# EAGLE design clock (EAGLE 9.6.0)
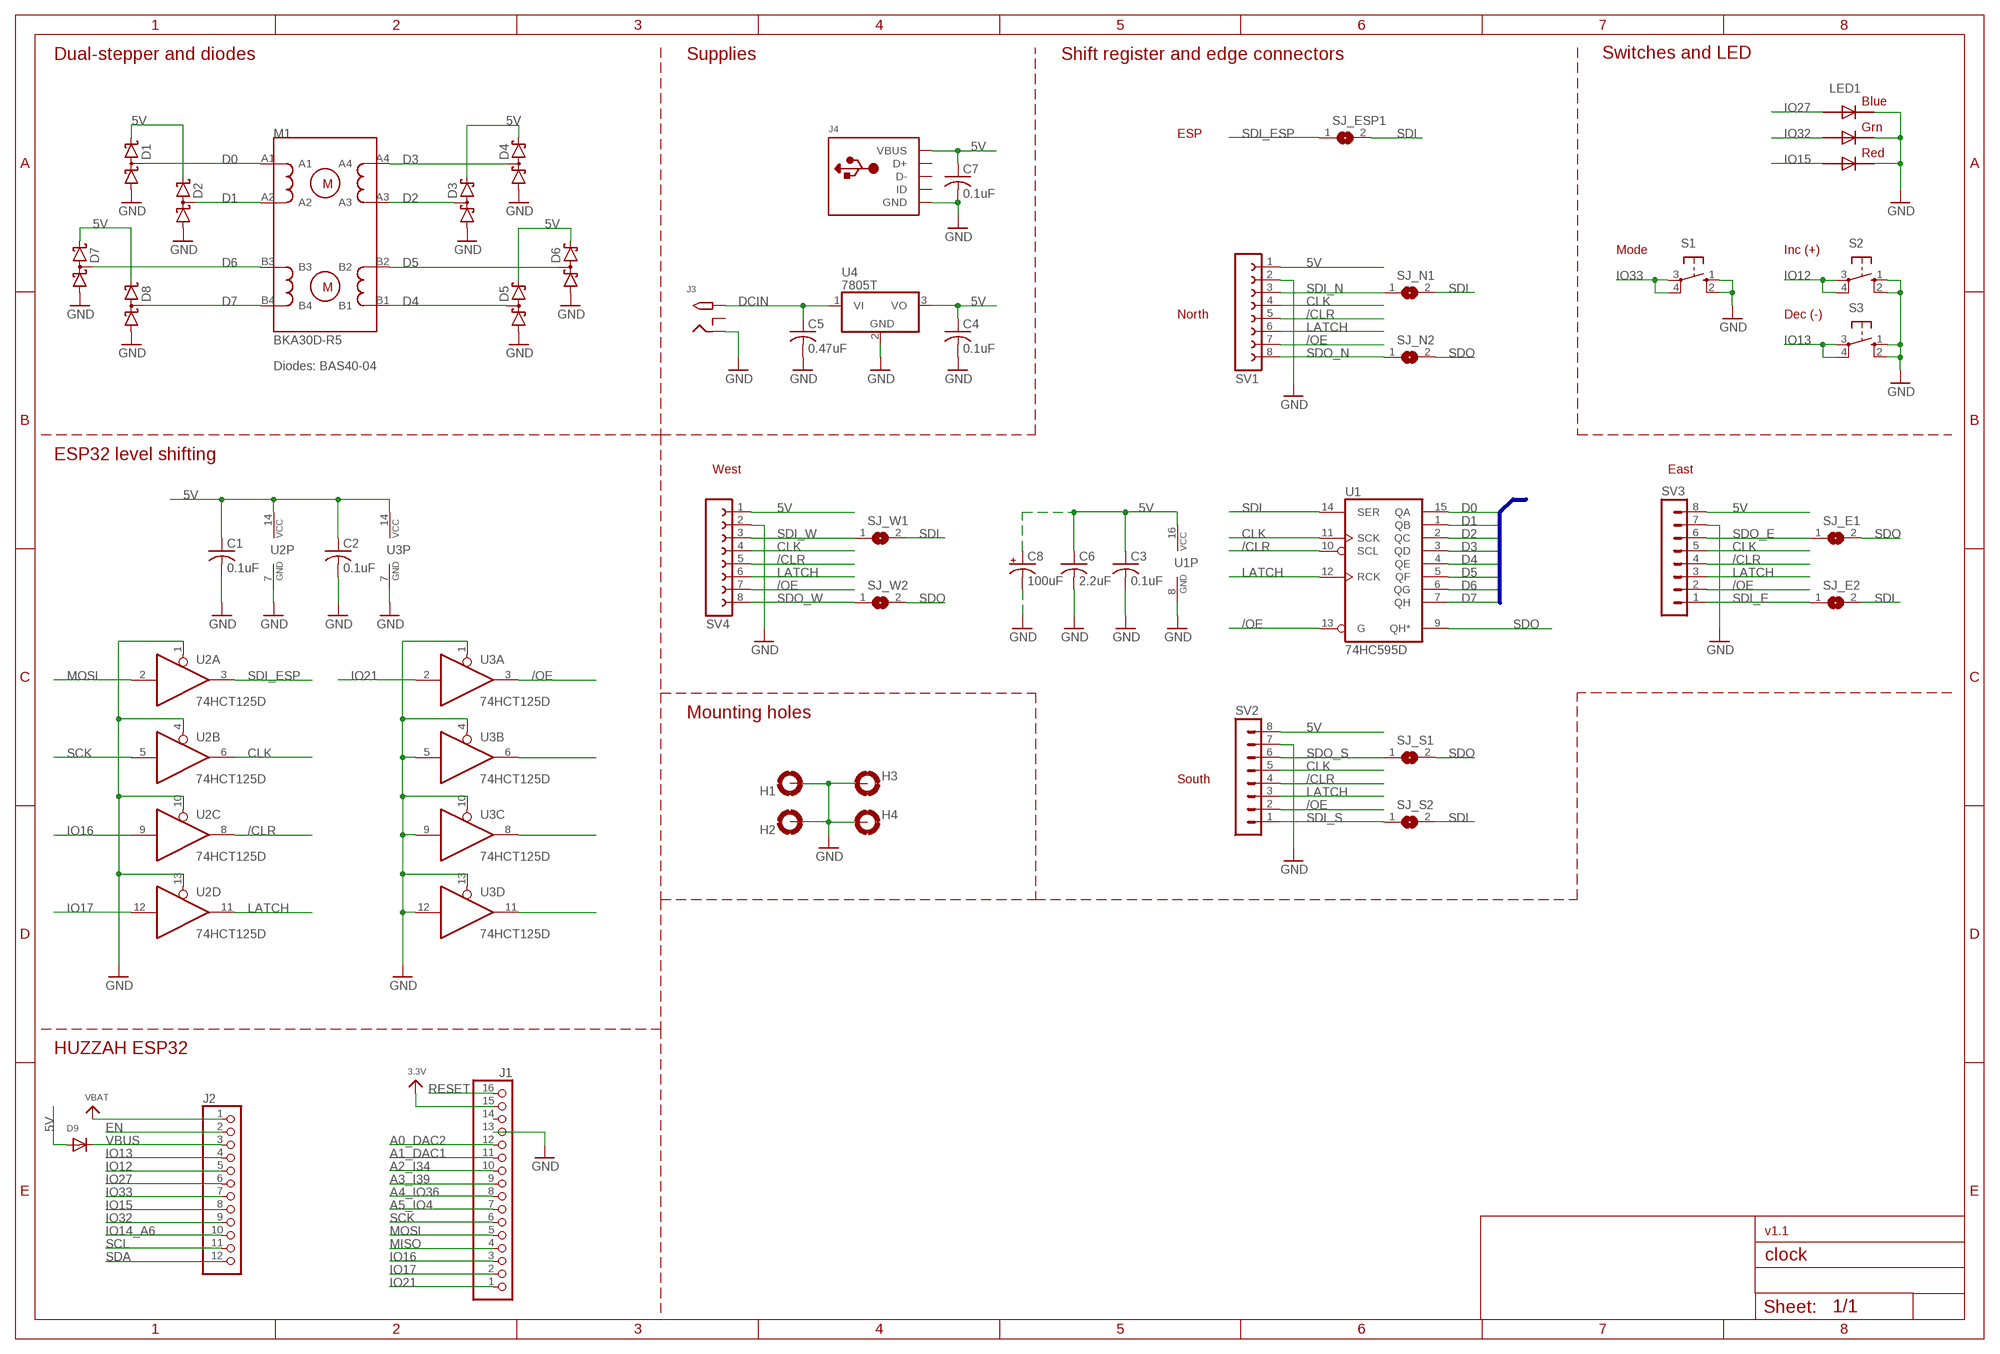
[diagram p0: schematic, sheet 1]

## Parts
C1  0.1uF  C-USC0805K  [C0805K]
C2  0.1uF  C-USC0805K  [C0805K]
C3  0.1uF  C-USC0805K  [C0805K]
C4  0.1uF  C-USC0805K  [C0805K]
C5  0.47uF  C-USC0805K  [C0805K]
C6  2.2uF  C-USC0805K  [C0805K]
C7  0.1uF  C-USC0805K  [C0805K]
C8  100uF  CPOL-USE3.5-8  [E3,5-8]
D1  BAS40-04  [SOT23]
D2  BAS40-04  [SOT23]
D3  BAS40-04  [SOT23]
D4  BAS40-04  [SOT23]
D5  BAS40-04  [SOT23]
D6  BAS40-04  [SOT23]
D7  BAS40-04  [SOT23]
D8  BAS40-04  [SOT23]
D9  DIODEDO-1N4148  [DO-1N4148]
H1  MOUNT-PAD-ROUND3.2  [3,2-PAD]
H2  MOUNT-PAD-ROUND3.2  [3,2-PAD]
H3  MOUNT-PAD-ROUND3.2  [3,2-PAD]
H4  MOUNT-PAD-ROUND3.2  [3,2-PAD]
J1  HEADER-1X16_MIN  [1X16_ROUND_MIN]
J2  HEADER-1X12_MIN  [1X12_ROUND_MIN]
J3  2.1MMJACKTHM  [PJ-102A]
J4  USBMINIB  [USB-MINIB]
LED1  RGBLED5050  [RGBLED5050]
M1  BKA30D-R5  [BKA30D-R5]
S1  10-XX  [B3F-10XX]
S2  10-XX  [B3F-10XX]
S3  10-XX  [B3F-10XX]
SJ_E1  SJ  [SJ]
SJ_E2  SJ  [SJ]
SJ_ESP1  SJ  [SJ]
SJ_N1  SJ  [SJ]
SJ_N2  SJ  [SJ]
SJ_S1  SJ  [SJ]
SJ_S2  SJ  [SJ]
SJ_W1  SJ  [SJ]
SJ_W2  SJ  [SJ]
SV1  FE08W  [FE08W]
SV2  MA08-1W  [MA08-1W]
SV3  MA08-1W  [MA08-1W]
SV4  FE08W  [FE08W]
U1  74HC595D  [SO16]
U2  74HCT125D  [SO14]
U3  74HCT125D  [SO14]
U4  7805T  [TO220H]

## Nets
3.3V: J1.15
5V: C1.1 C2.1 C3.1 C4.1 C6.1 C7.1 C8.+ D1.2(C2) D2.2(C2) D3.2(C2) D4.2(C2) D5.2(C2) D6.2(C2) D7.2(C2) D8.2(C2) D9.A J4.VBUS SV1.1 SV2.8 SV3.8 SV4.1 U1.16(VCC) U2.14(P:VCC) U3.14(P:VCC) U4.3(VO)
/CLR: SV1.5 SV2.4 SV3.4 SV4.5 U1.10(SCL) U2.8(C:O)
/OE: SV1.7 SV2.2 SV3.2 SV4.7 U1.13(G) U3.3(A:O)
A0_DAC2: J1.12
A1_DAC1: J1.11
A2_I34: J1.10
A3_I39: J1.9
A4_IO36: J1.8
A5_IO4: J1.7
CLK: SV1.4 SV2.5 SV3.5 SV4.4 U1.11(SCK) U2.6(B:O)
D0: D1.3(C1A2) M1.A1 U1.15(QA)
D1: D2.3(C1A2) M1.A2 U1.1(QB)
D2: D3.3(C1A2) M1.A3 U1.2(QC)
D3: D4.3(C1A2) M1.A4 U1.3(QD)
D4: D5.3(C1A2) M1.B1 U1.4(QE)
D5: D6.3(C1A2) M1.B2 U1.5(QF)
D6: D7.3(C1A2) M1.B3 U1.6(QG)
D7: D8.3(C1A2) M1.B4 U1.7(QH)
DCIN: C5.1 J3.TIP U4.1(VI)
EN: J2.2
GND: C1.2 C2.2 C3.2 C4.2 C5.2 C6.2 C7.2 C8.- D1.1(A1) D2.1(A1) D3.1(A1) D4.1(A1) D5.1(A1) D6.1(A1) D7.1(A1) D8.1(A1) H1.B3,2(MOUNT) H2.B3,2(MOUNT) H3.B3,2(MOUNT) H4.B3,2(MOUNT) J1.13 J3.RING J4.GND LED1.4(BLUE_C) LED1.5(RED_C) LED1.6(GREEN_C) S1.1(S) S1.2(S1) S2.1(S) S2.2(S1) S3.1(S) S3.2(S1) SV1.2 SV2.7 SV3.7 SV4.2 U1.8(GND) U2.1(A:OE) U2.4(B:OE) U2.7(P:GND) U2.10(C:OE) U2.13(D:OE) U3.1(A:OE) U3.4(B:OE) U3.5(B:I) U3.7(P:GND) U3.9(C:I) U3.10(C:OE) U3.12(D:I) U3.13(D:OE) U4.2(GND)
IO12: J2.5 S2.3(P) S2.4(P1)
IO13: J2.4 S3.3(P) S3.4(P1)
IO14_A6: J2.10
IO15: J2.8 LED1.2(RED_A)
IO16: J1.3 U2.9(C:I)
IO17: J1.2 U2.12(D:I)
IO21: J1.1 U3.2(A:I)
IO27: J2.6 LED1.3(BLUE_A)
IO32: J2.9 LED1.1(GREEN_A)
IO33: J2.7 S1.3(P) S1.4(P1)
LATCH: SV1.6 SV2.3 SV3.3 SV4.6 U1.12(RCK) U2.11(D:O)
MISO: J1.4
MOSI: J1.5 U2.2(A:I)
N$1: U3.11(D:O)
N$2: U3.8(C:O)
N$3: U3.6(B:O)
RESET: J1.16
SCK: J1.6 U2.5(B:I)
SCL: J2.11
SDA: J2.12
SDI: SJ_E2.2 SJ_ESP1.2 SJ_N1.2 SJ_S2.2 SJ_W1.2 U1.14(SER)
SDI_E: SJ_E2.1 SV3.1
SDI_ESP: SJ_ESP1.1 U2.3(A:O)
SDI_N: SJ_N1.1 SV1.3
SDI_S: SJ_S2.1 SV2.1
SDI_W: SJ_W1.1 SV4.3
SDO: SJ_E1.2 SJ_N2.2 SJ_S1.2 SJ_W2.2 U1.9(QH*)
SDO_E: SJ_E1.1 SV3.6
SDO_N: SJ_N2.1 SV1.8
SDO_S: SJ_S1.1 SV2.6
SDO_W: SJ_W2.1 SV4.8
VBAT: J2.1
VBUS: D9.C J2.3
Unconnected: J1.14 J3.RING_SW J4.D+ J4.D- J4.ID

## Buses
D[0..7]

## Notes on the sheet
- Dual-stepper and diodes | Supplies | Shift register and edge connectors | Switches and LED
- ESP
- Mode | Inc (+)
- North | Dec (-)
- Diodes: BAS40-04
- ESP32 level shifting
- West | East
- Mounting holes
- South
- HUZZAH ESP32
- v1.1

## Library data of the parts
C1-C7 = rcl:C-US: CAPACITOR, American symbol; SPICEPREFIX: C
C8 = rcl:CPOL-US: POLARIZED CAPACITOR, American symbol; SPICEPREFIX: C
D1-D8 = diode:BAS40-04: Silicon Schottky Diodes General-purpose diode for high-speed switching
D9 = adafruit:DIODE: Diode SMADIODE - SMA Surface Mount Package 20V 1A Schottky Diode Digikey: 641-1014-6-ND DO-1N4148 - Through Hole Small Current Diode SOD-123 20V 1 A (.5mV Vf) Schottky Diode - Digikey: MBRX120TPMSCT-ND SOD-323 10V 570mA (.38mV Vf, 3ns) Schottky Diode - Digikey: ZLLS410CT-ND SOD-523 30V 30mA Schottky Diode (RB751S-40TE61) - Digikey: RB751S-40TE61CT-ND SOT23-R/W - SOT23 Package (R = Solder Paste/Reflow Ovens, W = Hand-Soldering) BAT54Film 40V 300mA - Digikey: 497-7162-1-ND
H1-H4 = holes:MOUNT-PAD-ROUND: MOUNTING PAD, round
J1 = microbuilder:HEADER-1X16: PIN HEADER
J2 = microbuilder:HEADER-1X12
J3 = adafruit:2.1MMJACK: 2.1mm x 5.5mm THM DC jack with internal switch. Digikey part #PJ-102A, 4UCON part #05537 2.1mm x 5.5mm SMT DC jack with internal switch. Digikey part #PJ-002A-SMT, 4UCON part #03267 By microbuilder.eu & adafruit.com
J4 = adafruit:USB: USB Connectors USBMINIB - Surface Mount Female Mini-B USB Connector 4UConnector: 06564 By microbuilder.eu Thru-hole RA Female Mini-B USB Connector 4UConnector: 18732 By ladyada.net
LED1 = adafruit:RGBLED: For 5050 RGB LEDs, the order of the LEDs may vary from one manufacturer to another!
M1 = my_components:BKA30D-R5
S1-S3 = switch-omron:10-XX: OMRON SWITCH; MPN: B3F-1000; OC_FARNELL: 176432; OC_NEWARK: 36M3542
SJ_E1 SJ_E2 SJ_ESP1 SJ_N1 SJ_N2 SJ_S1 SJ_S2 SJ_W1 SJ_W2 = jumper:SJ: SMD solder JUMPER
SV1 SV4 = con-lsta:FE08W: FEMALE HEADER; OC_FARNELL: unknown; OC_NEWARK: unknown
SV2 SV3 = con-lstb:MA08-1W: PIN HEADER; OC_FARNELL: unknown; OC_NEWARK: unknown
U1 = 74xx-eu:74*595: 8-bit SHIFT REGISTER, output latch
U2 U3 = 74xx-eu:74*125: Quad bus BUFFER, 3-state
U4 = adafruit:78*: Positive VOLTAGE REGULATOR Added bigger pads to the TO-92 package

## Board
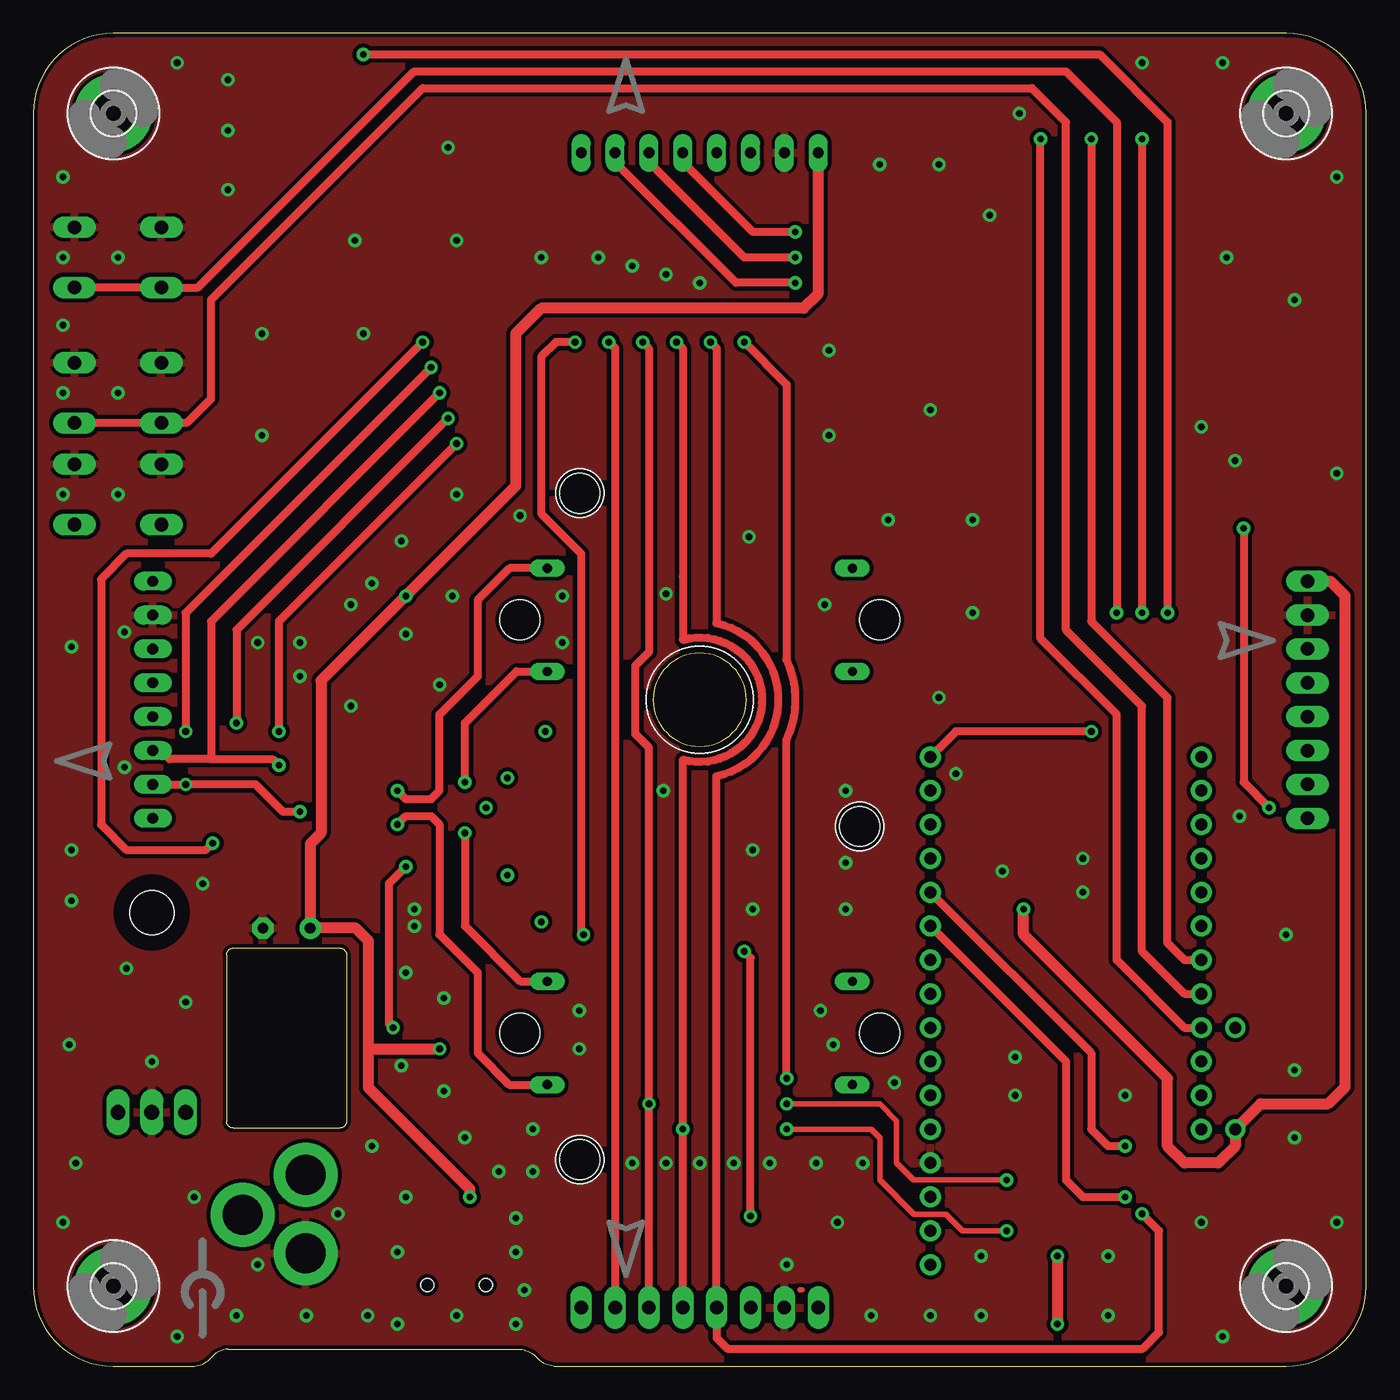
[diagram p1: board, top side]
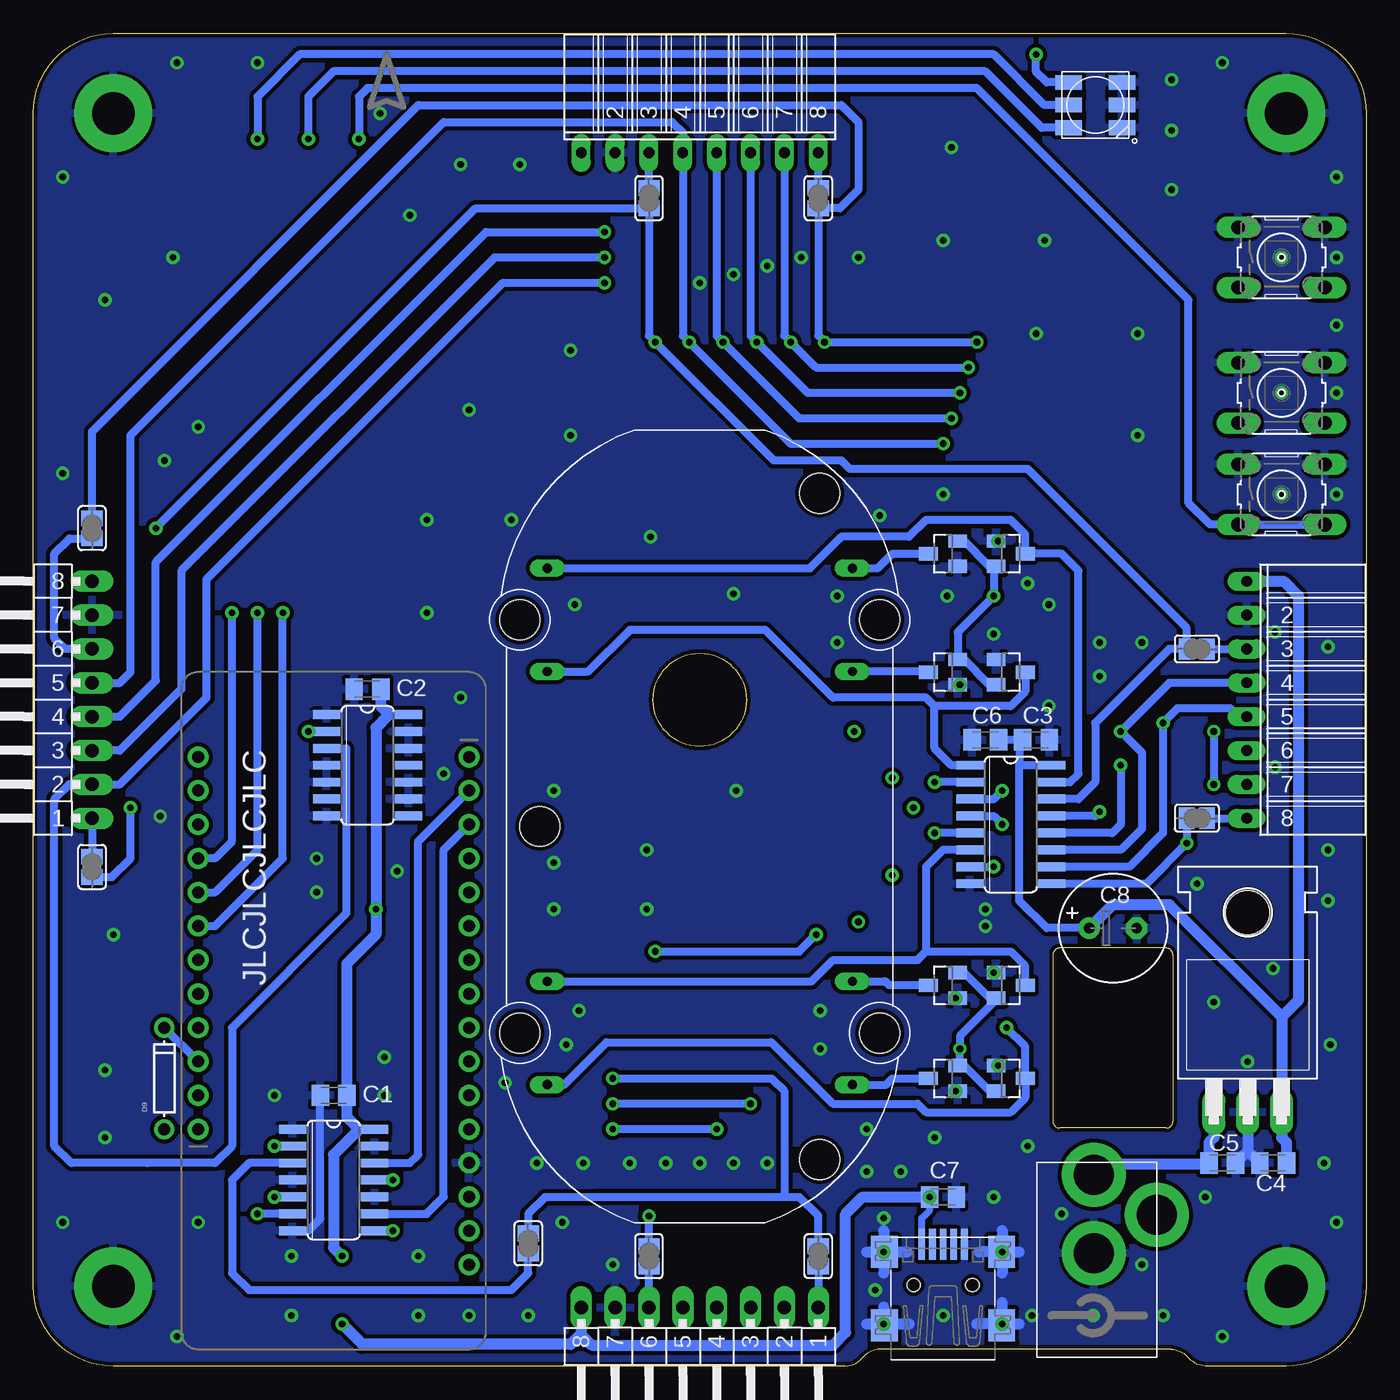
[diagram p2: board, bottom side, seen from below]

Size 100 x 100 mm. Coordinates in mm from the lower left corner, seen from the top.
Outline: 6,0 12.06,0 arc45 13.34,0.64 arc-45 14.61,1.27 36.51,1.27 arc-45 37.78,0.64 arc45 39.05,0 94,0 arc90 100,6 100,94 arc90 94,100 6,100 arc90 0,94 0,6 arc90 6,0
Outline: 14.5,30.86 14.5,18.36 arc90 15,17.86 23,17.86 arc90 23.5,18.36 23.5,30.86 arc90 23,31.36 15,31.36 arc90 14.5,30.86
Copper layers (1*16): Top 0.035559375mm / dielectric 1.6mm / Bottom 0.035559375mm
Design rules "jlcpcb2layer": minimum track width 5mil, minimum drill 8mil, track to track 5mil, track to pad 5mil, pad to pad 20mil, via to via 10mil, smd to smd 5mil, copper to edge 8mil, drill to drill 20mil, minimum pad ring 12mil, minimum via ring 5mil, stop-mask expansion 2.5mil, vias tented up to drill 20mil, thermal gap 10mil

### Footprints (pad centres in the part's own frame; a part is rotated, then mirrored left to right if it is on the bottom)
C0805K = smd 1.3 x 1.6: 1 -1,0; 2 1,0
E3,5-8 = drill 0.813 pad 1.6: + -1.778,0 | drill 0.813 pad 1.6 octagon: - 1.778,0
SOT23 = smd 1 x 1.4: 1 -0.95,-1.1; 2 0.95,-1.1; 3 0,1.1
DO-1N4148 = drill 0.9: A -3.81,0; C 3.81,0
3,2-PAD = drill 3.2 pad 5.842: B3,2 0,0
1X16_ROUND_MIN = drill 0.9 pad 1.575: 1 -19.05,0; 2 -16.51,0; 3 -13.97,0; 4 -11.43,0; 5 -8.89,0; 6 -6.35,0; 7 -3.81,0; 8 -1.27,0; 9 1.27,0; 10 3.81,0; 11 6.35,0; 12 8.89,0; 13 11.43,0; 14 13.97,0; 15 16.51,0; 16 19.05,0
1X12_ROUND_MIN = drill 0.9 pad 1.575: 1 -13.97,0; 2 -11.43,0; 3 -8.89,0; 4 -6.35,0; 5 -3.81,0; 6 -1.27,0; 7 1.27,0; 8 3.81,0; 9 6.35,0; 10 8.89,0; 11 11.43,0; 12 13.97,0
PJ-102A = drill 3 pad 4.8: RING 0.1,-3.39; RING_SW -4.6,-6.29; TIP 0.1,-9.29
USB-MINIB = smd 0.5 x 2.308: D+ 0,4.064; D- -0.8,4.064; GND 1.6,4.064; ID 0.8,4.064; VBUS -1.6,4.064 | smd 2 x 2.4: GND1 -4.4,-2; GND2 -4.4,3.5; GND3 4.4,3.5; GND4 4.4,-2 | hole 1: -2.2,1; 2.2,1
RGBLED5050 = smd 2 x 1.1: 1 -2,1.7; 2 -2,0; 3 -2,-1.7; 4 2,-1.7; 5 2,0; 6 2,1.7
BKA30D-R5 = drill 0.7 long: A1 19.375,11.45; A2 11.625,11.45; A3 11.625,-11.45; A4 19.375,-11.45; B1 -19.375,-11.45; B2 -11.625,-11.45; B3 -11.625,11.45; B4 -19.375,11.45 | hole 3: -15.5,13.5; -15.5,-13.5; 15.5,-13.5; 15.5,13.5; -25,-9; 25,-9; 0,12
B3F-10XX = drill 1.016 long: 1 -3.251,2.261; 2 3.251,2.261; 3 -3.251,-2.261; 4 3.251,-2.261
SJ = smd 1.168 x 1.6: 1 -0.762,0; 2 0.762,0
FE08W = drill 0.813 long: 1 -8.89,0; 2 -6.35,0; 3 -3.81,0; 4 -1.27,0; 5 1.27,0; 6 3.81,0; 7 6.35,0; 8 8.89,0
MA08-1W = drill 1.016 long: 1 -8.89,0; 2 -6.35,0; 3 -3.81,0; 4 -1.27,0; 5 1.27,0; 6 3.81,0; 7 6.35,0; 8 8.89,0
SO16 = smd 0.66 x 2.032: 1 -4.445,-3.073; 2 -3.175,-3.073; 3 -1.905,-3.073; 4 -0.635,-3.073; 5 0.635,-3.073; 6 1.905,-3.073; 7 3.175,-3.073; 8 4.445,-3.073; 9 4.445,3.073; 10 3.175,3.073; 11 1.905,3.073; 12 0.635,3.073; 13 -0.635,3.073; 14 -1.905,3.073; 15 -3.175,3.073; 16 -4.445,3.073
SO14 = smd 0.66 x 2.032: 1 -3.81,-3.073; 2 -2.54,-3.073; 3 -1.27,-3.073; 4 0,-3.073; 5 1.27,-3.073; 6 2.54,-3.073; 7 3.81,-3.073; 8 3.81,3.073; 9 2.54,3.073; 10 1.27,3.073; 11 0,3.073; 12 -1.27,3.073; 13 -2.54,3.073; 14 -3.81,3.073
TO220H = drill 1.118 long: 1 -2.54,-10.16; 2 0,-10.16; 3 2.54,-10.16 | hole 3.302: 0,4.826

### Placement (x,y rotation side)
C1  77.47,20.32 180 bottom
C2  74.93,50.8 180 bottom
C3  24.77,46.99 0 bottom
C4  6.99,15.24 180 bottom
C5  10.79,15.24 0 bottom
C6  28.57,46.99 180 bottom
C7  31.75,12.7 0 bottom
C8  19,32.87 0 bottom
D1  26.67,60.96 270 bottom
D2  26.67,52.07 270 bottom
D3  31.75,52.07 90 bottom
D4  31.75,60.96 90 bottom
D5  31.75,21.59 90 bottom
D6  31.75,28.57 90 bottom
D7  26.67,28.57 270 bottom
D8  26.67,21.59 270 bottom
D9  90.17,21.59 90 bottom
H1  6,94 0 top
H2  94,94 0 top
H3  6,6 0 top
H4  94,6 0 top
J1  67.31,26.67 270 bottom
J2  87.63,31.75 90 bottom
J3  20.32,5.08 180 bottom
J4  31.75,5.08 0 bottom
LED1  20.32,94.61 0 bottom
M1  50,40.5 90 bottom
S1  6.35,83.19 0 bottom
S2  6.35,73.03 0 bottom
S3  6.35,65.41 0 bottom
SJ_E1  95.6,62.87 90 bottom
SJ_E2  95.6,37.47 270 bottom
SJ_ESP1  62.87,9.21 90 bottom
SJ_N1  53.81,87.63 270 bottom
SJ_N2  41.11,87.63 270 bottom
SJ_S1  53.81,8.26 90 bottom
SJ_S2  41.11,8.26 90 bottom
SJ_W1  12.7,53.81 180 bottom
SJ_W2  12.7,41.11 180 bottom
SV1  50,91.04 0 bottom
SV2  50,4.4 180 bottom
SV3  95.6,50 90 bottom
SV4  8.96,50 270 bottom
U1  26.67,40.64 270 bottom
U2  77.47,13.97 270 bottom
U3  74.93,45.09 270 bottom
U4  8.89,29.21 0 bottom

### Tracks (layer width: path | path; a pad name or v marks a point on that pad's centre or on a via)
5V  (via drill 0.5 pad 1)
  Top 0.813: C7.1 32.75,13.29 25.14,20.9 25.14,23.81 | SV1.1 58.89,80.48 57.78,79.38 38.1,79.38 36.2,77.47 36.2,66.04 v27.94,57.78 21.59,51.44 21.59,40.01 20.78,39.19 C8.+ 24.18,32.87 25.14,31.91 25.14,23.81 | v76.83,8.26 v76.83,3.17 | SV3.8 97.32,58.89 98.42,57.78 98.42,20.95 97.16,19.68 92.08,19.68 D9.A 90.17,16.51 88.9,15.24 86.36,15.24 85.09,16.51 85.09,21.59 74.3,32.38 v74.3,34.29 | 25.14,23.81 v30.48,23.81
  Bottom 0.508: J4.VBUS 33.35,11.1 32.75,11.7 C7.1
  Bottom 0.61: 73.3,48.9 U3.14 | U2.14 75.56,17.78 | D6.2 30.16,29.52 28.26,27.62 D7.2 27.77,27.48 30.48,24.77 v30.48,23.81 30.48,22.71 D5.2 30.16,22.54 28.26,20.64 D8.2 | D2.2 28.26,51.12 30.16,53.02 D3.2 30.65,55.08 v27.94,57.78 27.94,59.84 D1.2 28.26,60.01 30.16,61.91 D4.2 | 26.04,45.09 26.04,46.72 C3.1 C6.1 | 26.04,45.09 26.04,34.92 23.98,32.87 C8.+ | U1.16 26.04,45.09
  Bottom 0.813: C2.1 73.93,49.53 73.3,48.9 74.3,47.9 v74.3,34.29 74.3,32.38 76.47,30.21 C1.1 76.47,18.68 75.56,17.78 77.47,15.88 77.47,8.89 v76.83,8.26 | C4.1 5.99,16.78 6.35,17.14 U4.3 6.35,26.19 | 6.35,26.19 14.77,34.61 19.04,34.61 C8.+ | v76.83,3.17 75.3,1.64 59.69,1.64 58.89,2.44 SV2.8 58.89,2.38 58.1,1.59 40.01,1.59 39.05,2.54 39.05,11.43 37.78,12.7 C7.1 | SV4.1 6.18,58.89 5.08,57.78 5.08,27.46 6.35,26.19
  other vias: 32.75,12.7
/CLR  (via drill 0.5 pad 1)
  Top 0.406: v73.03,10.16 69.7,10.16 68.46,11.4 66.06,11.4 63.5,13.97 63.5,17.14 62.87,17.78 v56.52,17.78
  Top 0.61: v31.11,71.12 15.24,55.24 v15.24,48.26 | SV1.5 48.73,90.33 53.98,85.09 v57.15,85.09 | SV2.4 v48.73,17.78 48.73,40.48 48.73,45.48 48.75,45.5 arc211 48.75,54.5 48.73,54.52 48.73,59.22 48.73,76.36 v48.26,76.83
  Bottom 0.61: SV4.5 9.6,48.73 10.23,49.37 14.13,49.37 v15.24,48.26 15.24,40.01 17.78,37.47 U1.10 | SV1.5 48.73,77.31 v48.26,76.83 42.55,71.12 v31.11,71.12 | SV3.4 93.51,48.73 90.81,51.44 90.81,60.33 66.04,85.09 v57.15,85.09 | U2.8 v73.03,10.16 | v48.73,17.78 v56.52,17.78
/OE  (via drill 0.5 pad 1)
  Top 0.61: v20,41.59 18.73,41.59 16.68,43.65 v11.43,43.65 SV4.7 | v11.43,47.62 11.43,56.52 v29.84,74.93 | v57.15,81.28 52.7,81.28 43.65,90.33 SV1.7 | v43.18,76.83 43.65,76.36 SV2.2
  Bottom 0.61: v20,41.59 20.32,41.27 U1.13 | SV1.7 43.65,77.31 v43.18,76.83 41.27,74.93 v29.84,74.93 | v11.43,47.62 v11.43,43.65 | v57.15,81.28 64.77,81.28 87,59.05 87,50.16 93.51,43.65 SV3.2 97.32,43.65 98.42,42.55 98.42,16.51 97.16,15.24 91.44,15.24 86.36,15.24 85.09,16.51 85.09,25.4 76.52,33.97 76.52,46.35 U3.3
CLK  (via drill 0.5 pad 1)
  Top 0.61: v31.75,69.22 18.41,55.88 v18.41,47.62 | v83.19,11.43 84.45,10.16 84.45,2.54 83.24,1.32 52.07,1.32 51.27,2.12 SV2.5 51.27,44.23 51.25,44.25 arc155 51.25,55.75 51.27,55.77 51.27,76.36 v50.8,76.83
  Bottom 0.61: SV4.4 14.77,51.27 v18.41,47.62 16.83,46.04 16.83,40.32 18.41,38.73 U1.11 | v31.75,69.22 43.18,69.22 v50.8,76.83 51.27,77.31 SV1.4 51.27,92.55 52.07,93.34 69.22,93.34 92.71,69.85 92.71,52.07 93.51,51.27 SV3.5 | U2.6 v83.19,11.43
D0
  Bottom 0.61: M1.A1 41.73,59.88 39.37,62.23 34.29,62.23 33.02,63.5 26.67,63.5 25.57,62.4 D1.3 22.86,60.96 21.59,59.69 21.59,44.45 22.23,43.81 U1.15
D1
  Bottom 0.61: D2.3 25.57,50.63 26.67,49.53 32.38,49.53 | 32.38,49.53 33.02,50.16 40.01,50.16 45.09,55.24 55.24,55.24 58.37,52.12 M1.A2 | U1.1 31.11,45.09 32.38,46.35 32.38,49.53
D2  (via drill 0.5 pad 1)
  Top 0.61: v32.38,43.81 32.38,48.26 36.25,52.12 M1.A3
  Bottom 0.61: D3.3 32.91,52.12 M1.A3 | U1.2 v32.38,43.81
D3  (via drill 0.5 pad 1)
  Top 0.61: M1.A4 35.74,59.88 33.34,57.47 33.34,51.75 30.48,48.9 30.48,43.18 29.84,42.55 27.94,42.55 v27.3,43.18
  Bottom 0.61: D4.3 35.56,60.96 36.65,59.88 M1.A4 | U1.3 27.94,42.55 v27.3,43.18
D4  (via drill 0.5 pad 1)
  Top 0.61: M1.B1 35.71,21.12 33.34,23.5 33.34,29.53 30.48,32.38 30.48,40.64 29.84,41.27 27.94,41.27 v27.3,40.64
  Bottom 0.61: M1.B1 36.02,21.12 35.56,21.59 D5.3 | U1.4 27.94,41.27 v27.3,40.64
D5  (via drill 0.5 pad 1)
  Top 0.61: v32.38,40.01 32.38,33.02 36.53,28.88 M1.B2
  Bottom 0.61: D6.3 35.77,28.57 36.07,28.88 M1.B2 | U1.5 v32.38,40.01
D6
  Bottom 0.61: D7.3 25.57,30.02 26.67,31.11 33.02,31.11 | M1.B3 41.61,28.88 40.01,30.48 33.66,30.48 33.02,31.11 | U1.6 31.75,38.73 33.02,37.47 33.02,31.11
D7  (via drill 0.5 pad 1)
  Top 0.61: v27.94,37.47 26.67,36.2 26.67,25.72 v26.99,25.4
  Bottom 0.61: M1.B4 60.18,21.12 57.01,24.3 44.62,24.3 40.01,19.68 33.66,19.68 33.02,19.05 26.67,19.05 25.57,20.15 D8.3 25.57,23.98 v26.99,25.4 | U1.7 v27.94,37.47
DCIN
  Bottom 0.813: U4.1 11.43,17.14 11.79,16.78 C5.1 11.86,15.17 19.62,15.17 J3.TIP
GND  (via drill 0.5 pad 1)
  Bottom 0.61: U2.7 79.38,10.16 78.47,11.06 C1.2 | D8.1 v27.62,22.54 | D1.1 v27.62,61.91 | D3.1 v30.48,51.12 | D7.1 v27.94,29.53 | D5.1 v30.8,20.64 | D6.1 v30.8,27.62
  Bottom 0.813: 8.89,16.14 C4.2 | U4.2 8.89,16.14 | 8.89,16.14 C5.2 | v27.3,3.17 26.04,3.17 | v27.3,3.17 27.3,4.76 | 27.3,10.16 v27.3,8.57 | v27.3,8.57 27.3,6.99 | v27.3,8.57 26.04,8.57 | 36.2,10.16 v36.2,8.57 | v36.2,8.57 36.2,6.99 | 37.47,8.57 v36.2,8.57 | 36.2,4.45 v36.2,3.17 | 37.47,3.17 v36.2,3.17 | v27.3,3.17 29.21,3.17 | v36.2,3.17 34.29,3.17 | v27.3,8.57 29.05,8.57 | v36.2,8.57 34.45,8.57
  other vias: 64.14,63.5 59.69,69.85 67.31,71.75 70.48,63.5 70.48,56.52 59.69,76.2 60.96,43.18 60.96,37.78 60.96,34.29 53.98,38.73 47.26,43.18 53.98,34.29 63.5,90.17 67.94,90.17 71.75,86.36 87.63,70.48 90.17,67.94 89.53,83.19 94.61,80.01 31.11,91.44 31.75,84.45 24.13,84.45 24.77,77.47 17.14,77.47 17.14,69.85 6.35,65.41 6.35,73.03 6.35,83.19 14.61,88.27 14.61,92.71 14.61,96.52 31.75,65.41 36.51,63.82 31.43,57.78 23.81,57.15 25.4,58.74 37.47,17.78 40.96,23.81 40.96,26.67 2.86,34.92 11.43,27.3 6.99,29.84 12.7,36.2 3.17,15.24 2.7,24.13 8.89,22.86 15.24,3.81 25.08,3.81 2.86,38.73 2.86,53.98 27.94,54.93 23.81,49.53 28.57,33.02 28.57,34.29 89.22,97.79 97.79,89.22 10.79,97.79 2.22,89.22 2.22,10.79 10.79,2.22 89.22,2.22 97.79,10.79 2.22,83.19 2.22,78.11 2.22,73.03 2.22,65.41 83.19,97.79 72.71,37.15 69.22,44.45 78.74,38.1 78.74,35.56 73.66,23.18 93.98,32.38 94.61,22.23 97.79,66.99 87.63,10.79 94.61,17.14 81.92,20.32 73.66,20.32 20.48,3.81 25.4,16.51 27.94,12.7 36.83,5.71 36.2,11.11 44.93,15.24 50.01,15.24 47.47,15.24 52.55,15.24 56.52,7.62 60.33,10.79 55.24,15.24 62.87,3.81 67.31,3.81 71.12,3.81 71.12,8.26 80.64,3.81 80.64,8.26 37.47,14.61 59.05,26.67 60.01,24.13 32.38,17.14 34.92,14.61 12.06,12.7 16.83,7.62 22.86,11.43 39.69,54.29 39.69,57.78 47.47,57.94 59.37,57.15 53.7,62.23 38.1,83.19 42.39,83.19 44.93,82.55 47.47,81.92 50.01,81.28 16.83,54.29 20,54.29 20,51.75 58.74,15.24 62.23,15.24 64.61,21.27 67.94,50.16 73.98,93.98 31.75,3.81 6.83,44.93 6.83,55.09 90.49,41.27
  pour Top (isolate 0.305): 0,100.33 0,0 100.33,0 100.33,100.33
  pour Bottom (isolate 0.305): 0,100.33 0,0 100.33,0 100.33,100.33
IO12
  Top 0.61: S2.4 S2.3 11.51,70.76 13.34,72.59 13.34,80.01 29.21,95.89 74.93,95.89 77.47,93.34 77.47,55.24 83.19,49.53 83.19,31.11 86.36,27.94 J2.5
IO13  (via drill 0.5 pad 1)
  Top 0.61: v75.56,92.08 75.56,54.61 81.28,48.9 81.28,30.48 86.36,25.4 J2.4
  Bottom 0.61: v75.56,92.08 75.56,95.25 74.93,95.89 29.21,95.89 13.34,80.01 13.34,64.77 11.71,63.14 S3.3 S3.4
IO15  (via drill 0.5 pad 1)
  Top 0.61: v83.19,92.08 v83.19,56.52
  Bottom 0.61: LED1.2 24.13,94.61 27.94,98.42 80.01,98.42 83.19,95.25 v83.19,92.08 | v83.19,56.52 83.19,38.73 86.36,35.56 J2.8
IO16
  Bottom 0.61: U2.9 70.48,11.43 69.22,12.7 69.22,38.73 J1.3
IO17
  Bottom 0.61: U2.12 71.75,15.24 71.12,15.88 71.12,39.37 J1.2
IO21  (via drill 0.5 pad 1)
  Top 0.61: v79.38,47.62 69.22,47.62 J1.1
  Bottom 0.61: U3.2 v79.38,47.62
IO27  (via drill 0.5 pad 1)
  Top 0.61: v79.38,92.08 79.38,55.88 85.09,50.16 85.09,31.75 86.36,30.48 J2.6
  Bottom 0.61: LED1.3 24.34,92.92 28.57,97.16 77.47,97.16 79.38,95.25 v79.38,92.08
IO32  (via drill 0.5 pad 1)
  Top 0.61: v24.77,98.42 80.01,98.42 85.09,93.34 v85.09,56.52
  Bottom 0.61: LED1.1 23.97,96.31 24.77,97.11 v24.77,98.42 | v85.09,56.52 85.09,39.37 86.36,38.1 J2.9
IO33  (via drill 0.5 pad 1)
  Top 0.61: v81.28,56.52 81.28,93.34 77.47,97.16 28.57,97.16 12.34,80.92 S1.3 S1.4
  Bottom 0.61: v81.28,56.52 81.28,38.1 86.36,33.02 J2.7
LATCH  (via drill 0.5 pad 1)
  Top 0.406: v73.03,13.97 66.04,13.97 64.77,15.24 64.77,18.41 63.5,19.68 v56.52,19.68
  Top 0.61: 13.34,45.55 10.23,45.55 9.6,46.19 SV4.6 | v30.48,73.03 13.34,55.88 13.34,45.55 | v18.41,45.09 17.95,45.55 13.34,45.55 | SV1.6 46.19,90.33 53.34,83.19 v57.15,83.19 | SV2.3 v46.19,19.68 46.19,46.41 45.18,47.42 45.18,52.55 46.19,53.56 46.19,76.36 v45.72,76.83
  Bottom 0.61: v18.41,45.09 18.41,40.64 19.05,40.01 U1.12 | SV1.6 46.19,77.31 v45.72,76.83 41.91,73.03 v30.48,73.03 | v57.15,83.19 65.41,83.19 88.9,59.69 88.9,50.8 93.51,46.19 SV3.3 | U2.11 v73.03,13.97 | v46.19,19.68 v56.52,19.68
MOSI  (via drill 0.5 pad 1)
  Top 0.61: v81.92,16.51 80.64,16.51 79.38,17.78 79.38,23.5 J1.5
  Bottom 0.61: v81.92,16.51 U2.2
N$4
  Top 0.406: 57.66,5.71 57.53,5.71
N$10  (via drill 0.5 pad 1)
  other vias: 38.42,47.62
N$11  (via drill 0.5 pad 1)
  other vias: 35.56,44.13
N$12  (via drill 0.5 pad 1)
  other vias: 33.97,41.91
N$13  (via drill 0.5 pad 1)
  other vias: 35.56,36.83
N$14  (via drill 0.5 pad 1)
  other vias: 38.1,33.34
SCK  (via drill 0.5 pad 1)
  Top 0.61: v81.92,12.7 78.74,12.7 77.47,13.97 77.47,22.86 J1.6
  Bottom 0.61: U2.5 v81.92,12.7
SDI  (via drill 0.5 pad 1)
  Top 0.61: v90.81,62.87 90.81,43.81 v92.71,41.91 | v53.34,76.83 56.52,73.66 56.52,53.02 56.5,53 arc-50 56.5,47 56.52,46.98 v56.52,21.59
  Bottom 0.61: U1.14 21.59,42.55 20.32,43.81 20.32,48.26 14.77,53.81 SJ_W1.2 13.46,55.37 25.4,67.31 38.73,67.31 39.37,67.94 44.45,67.94 v53.34,76.83 53.81,77.31 SJ_N1.2 66.8,86.87 v90.81,62.87 | SJ_E2.2 94.11,36.7 92.71,38.1 v92.71,41.91 | SJ_S2.2 41.11,11.27 42.55,12.7 43.66,12.7 | 43.66,12.7 57.81,12.7 57.83,12.68 61.62,12.68 62.87,11.43 SJ_ESP1.2 | v56.52,21.59 44.61,21.59 43.66,20.64 43.66,12.7
SDI_E
  Bottom 0.61: SV3.1 SJ_E2.1
SDI_ESP
  Bottom 0.61: U2.3 83.82,15.24 85.09,13.97 85.09,6.99 83.82,5.71 64.14,5.71 62.87,6.99 SJ_ESP1.1
SDI_N
  Bottom 0.61: SJ_N1.1 SV1.3
SDI_S
  Bottom 0.61: SJ_S2.1 SV2.1
SDI_W
  Bottom 0.61: SJ_W1.1 SV4.3
SDO  (via drill 0.5 pad 1)
  Top 0.61: v29.21,76.83 13.34,60.96 6.99,60.96 5.08,59.05 5.08,40.64 6.99,38.73 12.95,38.73 v13.46,39.24 | v53.34,31.11 53.81,30.64 v53.81,11.27 | v41.27,32.38 41.11,32.55 41.11,60.96 38.1,63.97 38.1,75.73 39.2,76.83 v40.64,76.83
  Bottom 0.61: v29.21,76.83 v40.64,76.83 41.11,77.31 SJ_N2.2 39.5,86.87 38.1,88.27 38.1,93.34 39.37,94.61 71.12,94.61 95.6,70.14 SJ_E1.2 | SJ_W2.2 v13.46,39.24 16.51,36.2 U1.9 | SJ_S1.2 v53.81,11.27 | v53.34,31.11 42.55,31.11 v41.27,32.38
SDO_E
  Bottom 0.61: SV3.6 97.62,53.81 98.42,54.61 98.42,60.96 97.28,62.1 SJ_E1.1
SDO_N
  Bottom 0.61: SJ_N2.1 SV1.8
SDO_S
  Bottom 0.61: SV2.6 SJ_S1.1
SDO_W
  Bottom 0.61: SJ_W2.1 SV4.8
VBUS
  Bottom 0.61: J2.3 D9.C

### Text on the board
bPlace: JLCJLCJLCJLC
tStop: ClockClock24
tDocu: North | v1.1 | Mode | (+) | (-) | East | West | - | South | + | 12V | DC | USB
bDocu: North | Status | < | IN | OUT | > | > | M | + | - | OUT | > | < | IN | > | HUZZAH32 | HCT125 | HC595 | OUT | > | < | IN | > | 7805 | HCT125 | > | > | > | OUT | 12VDC | USB | ESP / IN | IN | - | + | <